# EAGLE design ROM-el HN61256_v2 (EAGLE 7.7.0)
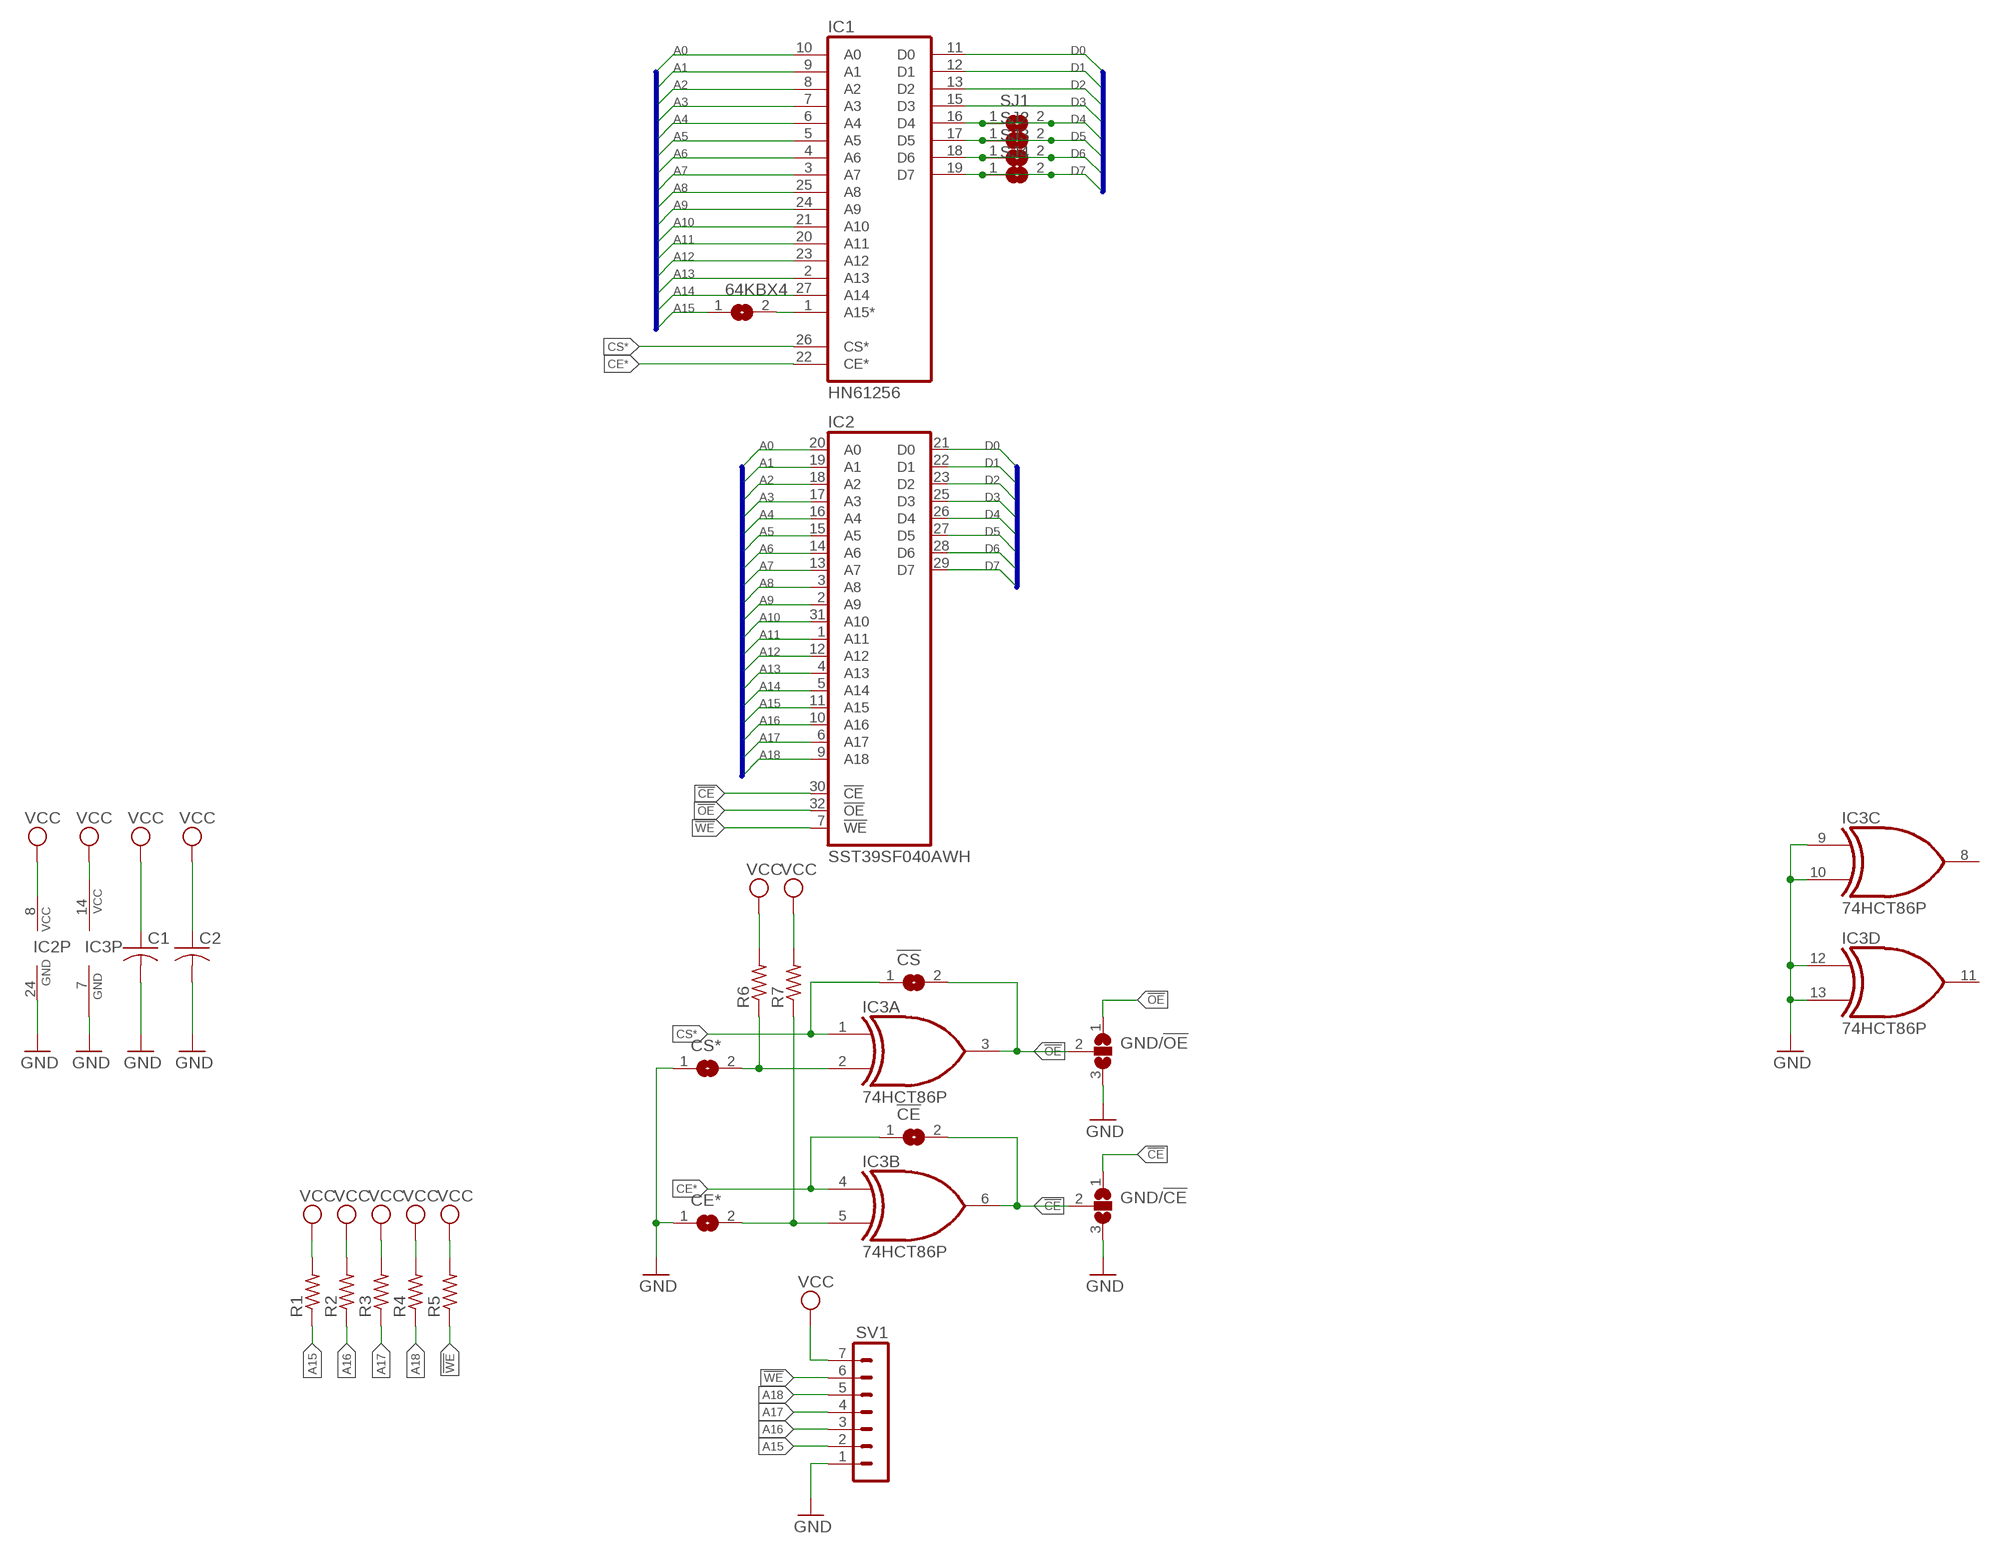
[diagram p0: schematic, sheet 1]

## Parts
64KBX4  SJ  [SJ]
!CE  SJ  [SJ]
!CS  SJ  [SJ]
C1  C-USC0402  [C0402]
C2  C-USC0402  [C0402]
CE*  SJ  [SJ]
CS*  SJ  [SJ]
GND/!CE  SJ2W  [SJ_2]
GND/!OE  SJ2W  [SJ_2]
IC1  HN61256  [DIL28-6]
IC2  SST39SF040AWH  [VSOP32]
IC3  74HCT86P  [TSSOP14]
R1  R-US_R0402  [R0402]
R2  R-US_R0402  [R0402]
R3  R-US_R0402  [R0402]
R4  R-US_R0402  [R0402]
R5  R-US_R0402  [R0402]
R6  R-US_R0402  [R0402]
R7  R-US_R0402  [R0402]
SJ1  SJ  [SJ]
SJ2  SJ  [SJ]
SJ3  SJ  [SJ]
SJ4  SJ  [SJ]
SV1  MA07-1  [MA07-1]

## Nets
!CE: !CE.2 GND/!CE.1 GND/!CE.2 IC2.30(!CE) IC3.6(B:O)
!OE: !CS.2 GND/!OE.1 GND/!OE.2 IC2.32(!OE) IC3.3(A:O)
!WE: IC2.7(!WE) R5.1 SV1.6
A0: IC1.10(A0) IC2.20(A0)
A1: IC1.9(A1) IC2.19(A1)
A2: IC1.8(A2) IC2.18(A2)
A3: IC1.7(A3) IC2.17(A3)
A4: IC1.6(A4) IC2.16(A4)
A5: IC1.5(A5) IC2.15(A5)
A6: IC1.4(A6) IC2.14(A6)
A7: IC1.3(A7) IC2.13(A7)
A8: IC1.25(A8) IC2.3(A8)
A9: IC1.24(A9) IC2.2(A9)
A10: IC1.21(A10) IC2.31(A10)
A11: IC1.20(A11) IC2.1(A11)
A12: IC1.23(A12) IC2.12(A12)
A13: IC1.2(A13) IC2.4(A13)
A14: IC1.27(A14) IC2.5(A14)
A15: 64KBX4.1 IC2.11(A15) R1.1 SV1.2
A16: IC2.10(A16) R2.1 SV1.3
A17: IC2.6(A17) R3.1 SV1.4
A18: IC2.9(A18) R4.1 SV1.5
CE*: !CE.1 IC1.22(CE*) IC3.4(B:I0)
CS*: !CS.1 IC1.26(CS*) IC3.1(A:I0)
D0: IC1.11(D0) IC2.21(D0)
D1: IC1.12(D1) IC2.22(D1)
D2: IC1.13(D2) IC2.23(D2)
D3: IC1.15(D3) IC2.25(D3)
D4: IC1.16(D4) IC2.26(D4) SJ1.1 SJ1.2
D5: IC1.17(D5) IC2.27(D5) SJ2.1 SJ2.2
D6: IC1.18(D6) IC2.28(D6) SJ3.1 SJ3.2
D7: IC1.19(D7) IC2.29(D7) SJ4.1 SJ4.2
GND: C1.2 C2.2 CE*.1 CS*.1 GND/!CE.3 GND/!OE.3 IC2.24(GND) IC3.7(P:GND) IC3.9(C:I0) IC3.10(C:I1) IC3.12(D:I0) IC3.13(D:I1) SV1.1
N$1: 64KBX4.2 IC1.1(A15*)
N$7: CS*.2 IC3.2(A:I1) R6.1
N$8: CE*.2 IC3.5(B:I1) R7.1
VCC: C1.1 C2.1 IC2.8(VCC) IC3.14(P:VCC) R1.2 R2.2 R3.2 R4.2 R5.2 R6.2 R7.2 SV1.7
Unconnected: IC3.8(C:O) IC3.11(D:O)

## Buses
A[0..18]
D[0..7]

## Power pins joined to a net without a drawn wire
GND: IC1.14(GND)
VCC: IC1.28(VCC)

## Library data of the parts
64KBX4 !CE !CS CE* CS* SJ1-SJ4 = jumper-jlb:SJ: SMD solder JUMPER
C1 C2 = rcl:C-US: CAPACITOR, American symbol
GND/!CE GND/!OE = jumper-jlb:SJ2W: SMD solder JUMPER
IC1 = memory-hitachi-jlb:HN61256
IC2 = memory-sst:SST39SF040A: 4 Mbit x8 Multi-Purpose Flash Source: http://www.sst.com/dotAsset/40782.pdf
IC3 = 74xx-us-jlb:74*86: Quad 2-input EXCLUSIV-OR (XOR) gate
R1-R7 = resistor:R-US_: RESISTOR, American symbol
SV1 = con-lstb-rp:MA07-1: PIN HEADER; OC_FARNELL: unknown; OC_NEWARK: unknown

## Board
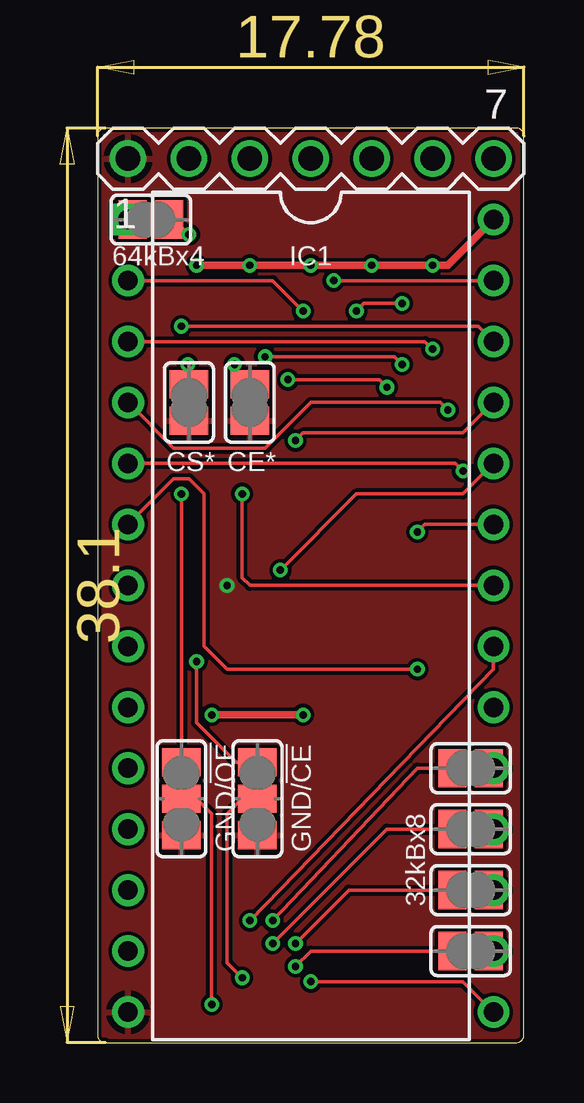
[diagram p1: board, top side]
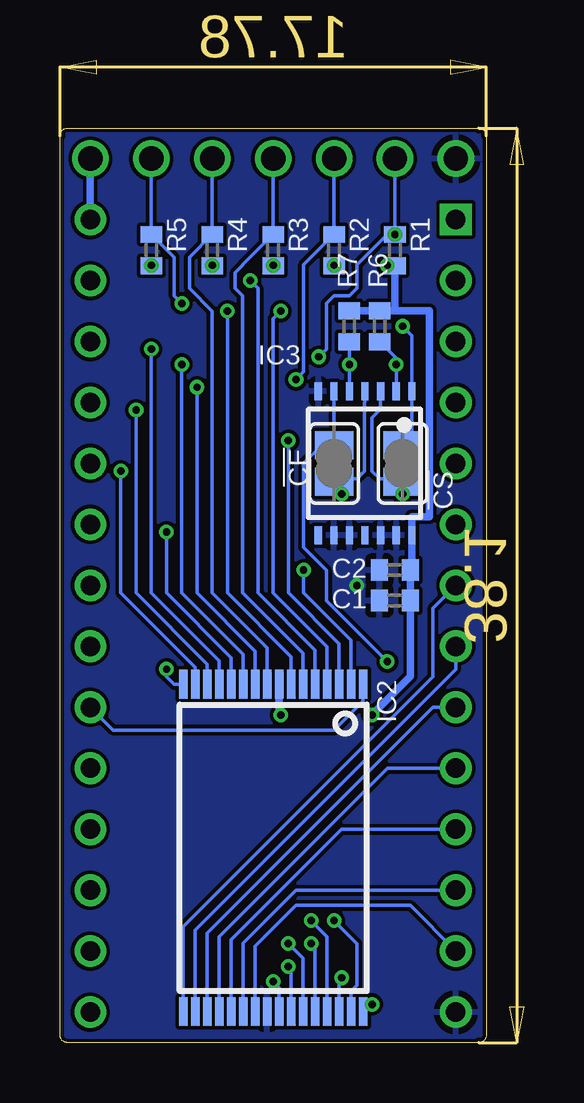
[diagram p2: board, bottom side, seen from below]

Size 17.78 x 38.1 mm. Coordinates in mm from the lower left corner, seen from the top.
Outline: 0,37.78 0,0.32 arc90 0.32,0 17.46,0 arc90 17.78,0.32 17.78,37.78 arc90 17.46,38.1 0.32,38.1 arc90 0,37.78
Copper layers (1*16): Top 0.035mm / dielectric 1.5mm / Bottom 0.035mm
Design rules "hackvana": minimum track width 6mil, minimum drill 0.3mm, track to track 6mil, track to pad 6mil, pad to pad 6mil, via to via 6mil, smd to smd 0mil, copper to edge 6mil, drill to drill 6mil, minimum pad ring 10mil, minimum via ring 6mil, stop-mask expansion 2mil, vias tented up to drill 100mil, thermal gap 10mil

### Footprints (pad centres in the part's own frame; a part is rotated, then mirrored left to right if it is on the bottom)
SJ = smd 1.168 x 1.6: 1 -0.762,0; 2 0.762,0
C0402 = smd 0.7 x 0.9: 1 -0.65,0; 2 0.65,0
SJ_2 = smd 1.168 x 1.6: 1 -1.524,0; 2 0,0; 3 1.524,0
DIL28-6 = drill 0.813 square: 1 -16.51,-7.62 | drill 0.813: 2 -13.97,-7.62; 3 -11.43,-7.62; 4 -8.89,-7.62; 5 -6.35,-7.62; 6 -3.81,-7.62; 7 -1.27,-7.62; 8 1.27,-7.62; 9 3.81,-7.62; 10 6.35,-7.62; 11 8.89,-7.62; 12 11.43,-7.62; 13 13.97,-7.62; 14 16.51,-7.62; 15 16.51,7.62; 16 13.97,7.62; 17 11.43,7.62; 18 8.89,7.62; 19 6.35,7.62; 20 3.81,7.62; 21 1.27,7.62; 22 -1.27,7.62; 23 -3.81,7.62; 24 -6.35,7.62; 25 -8.89,7.62; 26 -11.43,7.62; 27 -13.97,7.62; 28 -16.51,7.62
VSOP32 = smd 1.2 x 0.36: 1 -7.31,3.75; 2 -7.31,3.25; 3 -7.31,2.75; 4 -7.31,2.25; 5 -7.31,1.75; 6 -7.31,1.25; 7 -7.31,0.75; 8 -7.31,0.25; 9 -7.31,-0.25; 10 -7.31,-0.75; 11 -7.31,-1.25; 12 -7.31,-1.75; 13 -7.31,-2.25; 14 -7.31,-2.75; 15 -7.31,-3.25; 16 -7.31,-3.75; 17 6.322,-3.75; 18 6.322,-3.25; 19 6.322,-2.75; 20 6.322,-2.25; 21 6.322,-1.75; 22 6.322,-1.25; 23 6.322,-0.75; 24 6.322,-0.25; 25 6.322,0.25; 26 6.322,0.75; 27 6.322,1.25; 28 6.322,1.75; 29 6.322,2.25; 30 6.322,2.75; 31 6.322,3.25; 32 6.322,3.75
TSSOP14 = smd 0.75 x 0.3: 1 -3,1.972; 2 -3,1.323; 3 -3,0.672; 4 -3,0.022; 5 -3,-0.627; 6 -3,-1.278; 7 -3,-1.927; 8 3,-1.927; 9 3,-1.278; 10 3,-0.627; 11 3,0.022; 12 3,0.672; 13 3,1.323; 14 3,1.972
R0402 = smd 0.7 x 0.9: 1 -0.65,0; 2 0.65,0
MA07-1 = drill 1.016: 1 -7.62,0; 2 -5.08,0; 3 -2.54,0; 4 0,0; 5 2.54,0; 6 5.08,0; 7 7.62,0

### Placement (x,y rotation side)
64KBX4  2.22,34.29 180 top
!CE  6.35,24.13 90 bottom
!CS  3.49,24.13 270 bottom
C1  3.81,18.41 180 bottom
C2  3.81,19.68 180 bottom
CE*  6.35,26.67 90 top
CS*  3.81,26.67 90 top
GND/!CE  6.67,10.16 270 top
GND/!OE  3.49,10.16 270 top
IC1  8.89,17.78 270 top
IC2  8.89,7.62 270 bottom
IC3  5.08,24.13 270 bottom
R1  3.81,33.02 270 bottom
R2  6.35,33.02 270 bottom
R3  8.89,33.02 270 bottom
R4  11.43,33.02 270 bottom
R5  13.97,33.02 270 bottom
R6  4.45,29.84 90 bottom
R7  5.72,29.84 90 bottom
SJ1  15.56,3.81 180 top
SJ2  15.56,6.35 180 top
SJ3  15.56,8.89 180 top
SJ4  15.56,11.43 180 top
SV1  8.89,36.83 0 top

### Tracks (layer width: path | path; a pad name or v marks a point on that pad's centre or on a via)
!CE  (via drill 0.3)
  Top 0.152: v6.03,2.7 5.4,3.33 5.4,9.53 6.03,10.16 GND/!CE.2 GND/!CE.1 5.78,11.68 4.13,13.34 4.13,15.56 3.97,15.72 v4.13,15.88
  Bottom 0.152: IC3.6 !CE.2 6.86,24.89 7.62,24.13 7.62,20.64 6.67,19.68 6.67,18.41 v4.13,15.88 | IC2.30 6.14,2.59 v6.03,2.7
!OE  (via drill 0.3)
  Top 0.152: v3.49,22.86 GND/!OE.1 GND/!OE.2 4.13,10.16 4.76,9.53 v4.76,1.59
  Bottom 0.152: IC2.32 5.05,1.3 v4.76,1.59 | IC3.3 4.41,26.39 4.76,26.04 4.76,23.81 4.45,23.5 3.94,23.5 !CS.2 v3.49,22.86
!WE  (via drill 0.3)
  Top 0.152: v10.79,30.48 11.11,30.8 v12.7,30.8
  Bottom 0.152: IC2.7 8.14,16.08 10.79,18.73 v10.79,30.48 | SV1.6 R5.1 13.02,32.72 13.02,31.11 v12.7,30.8
A0
  Bottom 0.152: IC2.20 11.14,4.42 4.13,11.43 IC1.10
A1
  Bottom 0.152: IC2.19 11.64,4.55 2.22,13.97 IC1.9
A2
  Bottom 0.152: IC2.18 12.14,4.69 1.27,15.56 IC1.8
A3
  Bottom 0.152: IC2.17 12.64,4.82 2.22,15.24 2.22,18.1 IC1.7
A4  (via drill 0.3)
  Top 0.152: v13.34,15.56 5.4,15.56 4.45,16.51 4.45,22.86 3.81,23.5 3.18,23.5 IC1.6
  Bottom 0.152: IC2.16 13.01,14.93 13.02,14.92 13.34,15.24 v13.34,15.56
A5  (via drill 0.3)
  Top 0.152: IC1.5 14.92,24.13 v15.24,23.81
  Bottom 0.152: IC2.15 12.14,15.63 15.24,18.73 v15.24,23.81
A6  (via drill 0.3)
  Top 0.152: v14.61,26.35 14.29,26.67 8.89,26.67 6.99,24.77 3.18,24.77 IC1.4
  Bottom 0.152: IC2.14 11.64,15.77 14.61,18.73 v14.61,26.35
A7  (via drill 0.3)
  Top 0.152: IC1.3 13.65,29.21 v13.97,28.89
  Bottom 0.152: IC2.13 11.14,15.9 13.97,18.73 v13.97,28.89
A8  (via drill 0.3)
  Top 0.152: IC1.25 15.24,25.4 8.57,25.4 v8.26,25.08
  Bottom 0.152: IC2.3 6.14,16.62 8.26,18.73 v8.26,25.08
A9  (via drill 0.3)
  Top 0.152: IC1.24 15.24,22.86 10.79,22.86 v7.62,19.68
  Bottom 0.152: v7.62,19.68 7.62,18.73 5.64,16.75 IC2.2
A10  (via drill 0.3)
  Top 0.152: v6.35,5.08 16.51,15.56 IC1.21
  Bottom 0.152: IC2.31 5.64,2.14 5.4,2.38 5.4,4.13 v6.35,5.08
A11
  Bottom 0.152: IC2.1 5.14,14.23 6.35,13.02 15.56,13.02 IC1.20
A12  (via drill 0.3)
  Top 0.152: v13.34,21.27 13.65,21.59 IC1.23
  Bottom 0.152: IC2.12 10.64,16.04 13.34,18.73 v13.34,21.27
A13  (via drill 0.3)
  Top 0.152: IC1.2 7.3,31.75 v8.57,30.48
  Bottom 0.152: IC2.4 6.64,16.48 8.89,18.73 8.89,30.16 v8.57,30.48
A14  (via drill 0.3)
  Top 0.152: IC1.27 v9.84,31.75
  Bottom 0.152: IC2.5 7.14,16.35 9.53,18.73 9.53,31.43 v9.84,31.75
A15  (via drill 0.3)
  Top 0.152: v12.7,28.26 12.38,28.57 v6.99,28.57 | 64KBX4.1 3.16,34.29 R1.1
  Bottom 0.152: IC2.11 10.14,16.17 12.7,18.73 v12.7,28.26 | v6.99,28.57 6.67,28.89 6.67,30.8 6.35,31.11 5.72,31.11 5.4,31.43 5.4,32.4 4.13,33.67 R1.1 SV1.2
  other vias: 3.81,33.67
A16  (via drill 0.3)
  Top 0.152: v12.07,27.3 11.75,27.62 v7.94,27.62
  Bottom 0.152: IC2.10 9.64,16.31 12.07,18.73 v12.07,27.3 | SV1.3 R2.1 7.62,32.4 7.62,27.94 v7.94,27.62
A17
  Bottom 0.152: IC2.6 7.64,16.21 10.16,18.73 10.16,31.11 10.48,31.43 10.48,32.07 10.16,32.38 10.16,32.4 R3.1 SV1.4
A18
  Bottom 0.152: IC2.9 9.14,16.44 11.43,18.73 11.43,30.48 12.38,31.43 12.38,32.72 R4.1 SV1.5
CE*  (via drill 0.3)
  Top 0.152: IC1.22 6.35,19.05 6.03,19.37 v6.03,22.86
  Bottom 0.152: v6.03,22.86 6.03,23.05 !CE.1 6.22,23.5 5.4,23.5 5.08,23.81 5.08,26.67 5.06,26.69 IC3.4
CS*  (via drill 0.3)
  Top 0.152: IC1.26 15.88,29.84 v3.49,29.84
  Bottom 0.152: v3.49,29.84 3.11,29.46 IC3.1 3.11,25.28 !CS.1
D0
  Bottom 0.152: IC2.21 10.64,4.28 6.03,8.89 IC1.11
D1
  Bottom 0.152: IC2.22 10.14,4.15 7.94,6.35 IC1.12
D2
  Bottom 0.152: IC2.23 9.64,4.01 7.94,5.71 3.18,5.71 IC1.13
D3  (via drill 0.3)
  Top 0.152: v8.89,2.54 15.24,2.54 IC1.15
  Bottom 0.152: IC2.25 8.64,2.29 v8.89,2.54
D4  (via drill 0.3)
  Top 0.152: v8.26,3.17 8.89,3.81 SJ1.2 SJ1.1 IC1.16
  Bottom 0.152: IC2.26 8.14,3.06 v8.26,3.17
D5  (via drill 0.3)
  Top 0.152: v8.26,4.13 10.48,6.35 SJ2.2 SJ2.1 IC1.17
  Bottom 0.152: IC2.27 7.64,3.51 v8.26,4.13
D6  (via drill 0.3)
  Top 0.152: v7.3,4.13 12.07,8.89 SJ3.2 SJ3.1 IC1.18
  Bottom 0.152: IC2.28 7.14,3.96 v7.3,4.13
D7  (via drill 0.3)
  Top 0.152: v7.3,5.08 13.34,11.43 SJ4.2 SJ4.1 IC1.19
  Bottom 0.152: IC2.29 6.64,4.42 v7.3,5.08
GND  (via drill 0.3)
  other vias: 5.4,19.05
  pour Top: 17.78,37.78 17.78,0.32 arc-90 17.46,0 0.32,0 arc-90 0,0.32 0,37.78 arc-90 0.32,38.1 17.46,38.1 arc-90
  pour Bottom: 17.78,37.78 17.78,0.32 arc-90 17.46,0 0.32,0 arc-90 0,0.32 0,37.78 arc-90 0.32,38.1 17.46,38.1 arc-90
N$1
  Top 0.152: 1.91,34.29 64KBX4.2 IC1.1
N$7  (via drill 0.3)
  Top 0.152: CS*.2 3.76,27.48 v3.76,28.26
  Bottom 0.152: R6.1 3.76,28.51 v3.76,28.26 3.76,27.62 IC3.2
N$8  (via drill 0.3)
  Top 0.152: CE*.2 5.71,27.43 v5.71,28.26
  Bottom 0.152: v5.71,28.26 5.71,29.19 R7.1 5.71,29.2 v5.71,28.26 | v5.71,28.26 IC3.5
VCC  (via drill 0.3)
  Top 0.305: v4.13,32.38 v6.35,32.38 v8.89,32.38 v11.43,32.38 v13.97,32.38 14.61,32.38 IC1.28 | v8.57,13.65 v4.76,13.65
  Bottom 0.152: R1.2 4.11,32.37 v4.13,32.38 | R5.2 v13.97,32.38 | R4.2 v11.43,32.38 | R3.2 v8.89,32.38 | R2.2 v6.35,32.38
  Bottom 0.305: IC2.8 8.64,13.72 v8.57,13.65 | IC1.28 SV1.7 | v4.76,13.65 3.16,15.26 C1.1 C2.1 3.11,19.74 IC3.14 3.11,21.91 2.38,21.91 2.38,30.5 3.81,30.5 | R7.2 R6.2 3.81,30.5 | 3.81,30.5 R1.2

### Text on the board
tNames: 64kBx4 | 32kBx8